# EAGLE schematic uC_ATMEL (EAGLE 7.1.0)

## Sheet 1 of 5: uC Pinout
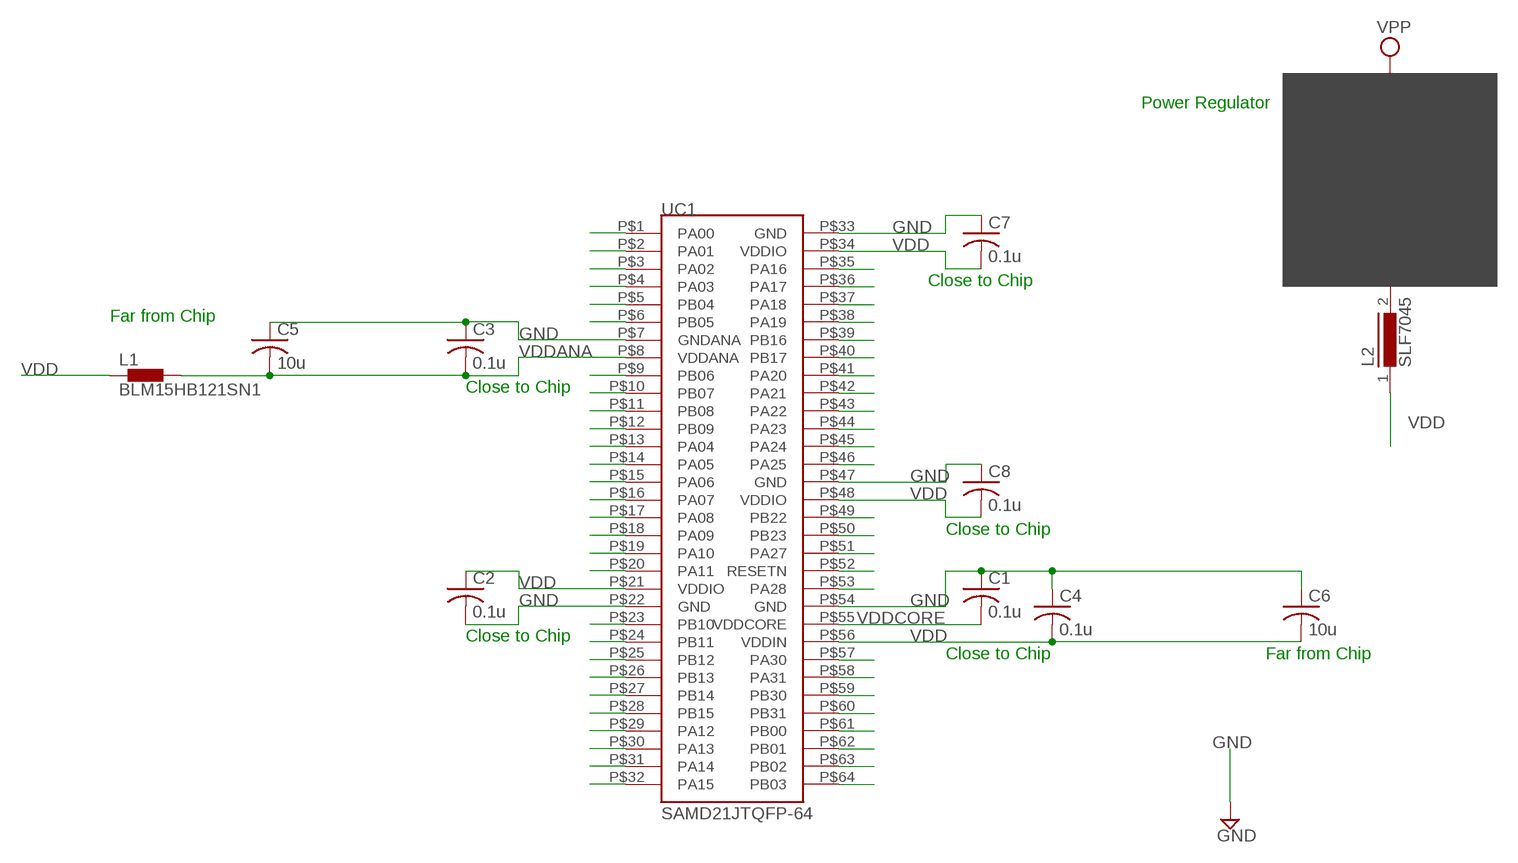
[diagram p0: schematic, sheet 1]

### Parts
C1  0.1u  C-USC1812  [C1812]
C2  0.1u  C-USC1812  [C1812]
C3  0.1u  C-USC1812  [C1812]
C4  0.1u  C-USC1812  [C1812]
C5  10u  C-USC1206  [C1206]
C6  10u  C-USC1206  [C1206]
C7  0.1u  C-USC1812  [C1812]
C8  0.1u  C-USC1812  [C1812]
L1  BLM15HB121SN1  [0402]
L2  SLF7045  [SLF7045]
UC1  SAMD21JTQFP-64  [TQFP-64]

### Nets
GND: C1.1 C2.2 C3.1 C4.1 C5.1 C6.1 C7.1 C8.1 UC1.P$7(GNDANA) UC1.P$22(GND) UC1.P$33(GND) UC1.P$47(GND) UC1.P$54(GND) ; also sheet 2,3,5
PA00: UC1.P$1(PA00)
PA01: UC1.P$2(PA01)
PA02: UC1.P$3(PA02)
PA03: UC1.P$4(PA03)
PA04: UC1.P$13(PA04) ; also sheet 3,5
PA05: UC1.P$14(PA05) ; also sheet 3,5
PA06: UC1.P$15(PA06)
PA07: UC1.P$16(PA07)
PA08: UC1.P$17(PA08)
PA09: UC1.P$18(PA09)
PA10: UC1.P$19(PA10)
PA11: UC1.P$20(PA11)
PA12: UC1.P$29(PA12)
PA13: UC1.P$30(PA13) ; also sheet 3
PA14: UC1.P$31(PA14) ; also sheet 3
PA15: UC1.P$32(PA15) ; also sheet 3
PA16: UC1.P$35(PA16) ; also sheet 3
PA17: UC1.P$36(PA17)
PA18: UC1.P$37(PA18)
PA19: UC1.P$38(PA19) ; also sheet 2
PA20: UC1.P$41(PA20) ; also sheet 2
PA21: UC1.P$42(PA21) ; also sheet 2
PA22: UC1.P$43(PA22) ; also sheet 3
PA23: UC1.P$44(PA23) ; also sheet 3
PA24: UC1.P$45(PA24)
PA25: UC1.P$46(PA25)
PA27: UC1.P$51(PA27) ; also sheet 5
PA28: UC1.P$53(PA28) ; also sheet 5
PA30: UC1.P$57(PA30) ; also sheet 2
PA31: UC1.P$58(PA31) ; also sheet 2
PB00: UC1.P$61(PB00) ; also sheet 3
PB01: UC1.P$62(PB01)
PB02: UC1.P$63(PB02)
PB03: UC1.P$64(PB03)
PB04: UC1.P$5(PB04)
PB05: UC1.P$6(PB05)
PB06: UC1.P$9(PB06)
PB07: UC1.P$10(PB07)
PB08: UC1.P$11(PB08)
PB09: UC1.P$12(PB09)
PB10: UC1.P$23(PB10)
PB11: UC1.P$24(PB11)
PB12: UC1.P$25(PB12)
PB13: UC1.P$26(PB13)
PB14: UC1.P$27(PB14)
PB15: UC1.P$28(PB15)
PB16: UC1.P$39(PB16) ; also sheet 2
PB17: UC1.P$40(PB17) ; also sheet 2
PB22: UC1.P$49(PB22) ; also sheet 5
PB23: UC1.P$50(PB23) ; also sheet 5
PB30: UC1.P$59(PB30)
PB31: UC1.P$60(PB31)
RESETN: UC1.P$52(RESETN) ; also sheet 2
VDD: C2.1 C4.2 C6.2 C7.2 C8.2 L1.1 L2.1 UC1.P$21(VDDIO) UC1.P$34(VDDIO) UC1.P$48(VDDIO) UC1.P$56(VDDIN) ; also sheet 2,3,5
VDDANA: C3.2 C5.2 L1.2 UC1.P$8(VDDANA)
VDDCORE: C1.2 UC1.P$55(VDDCORE)
Unconnected: L2.2

### Notes on the sheet
- Power Regulator
- Close to Chip
- Far from Chip
- Close to Chip
- Close to Chip
- Close to Chip
- Close to Chip | Far from Chip

## Sheet 2 of 5: Bootloading & Programming
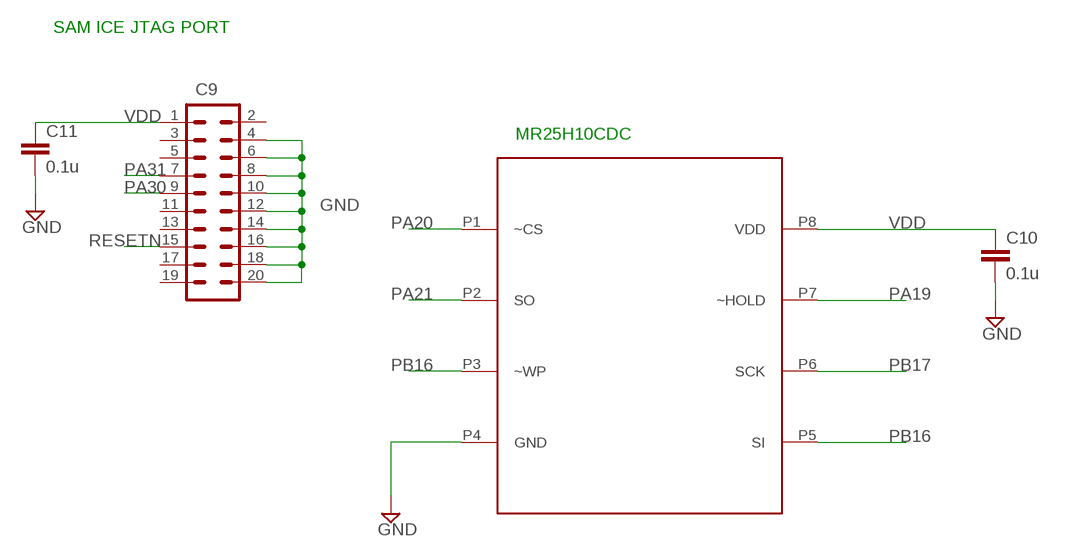
[diagram p1: schematic, sheet 2]

### Parts
C9  IDC_JTAG_CONNECTOR  [2X10]
C10  0.1u  CAP0805  [0805]
C11  0.1u  CAP0805  [0805]
U$1  MR25H10CDC  [8PXMO-229]

### Nets
GND: C9.4 C9.6 C9.8 C9.10 C9.12 C9.14 C9.16 C9.18 C9.20 C10.2 C11.2 U$1.P4(GND) ; also sheet 1,3,5
PA19: U$1.P7(~HOLD) ; also sheet 1
PA20: U$1.P1(~CS) ; also sheet 1
PA21: U$1.P2(SO) ; also sheet 1
PA30: C9.9 ; also sheet 1
PA31: C9.7 ; also sheet 1
PB16: U$1.P3(~WP) U$1.P5(SI) ; also sheet 1
PB17: U$1.P6(SCK) ; also sheet 1
RESETN: C9.15 ; also sheet 1
VDD: C9.1 C10.1 C11.1 U$1.P8(VDD) ; also sheet 1,3,5
Unconnected: C9.2 C9.3 C9.5 C9.11 C9.13 C9.17 C9.19

### Notes on the sheet
- SAM ICE JTAG PORT
- MR25H10CDC

## Sheet 3 of 5: TempSensing/Pwr/FlashCntrl
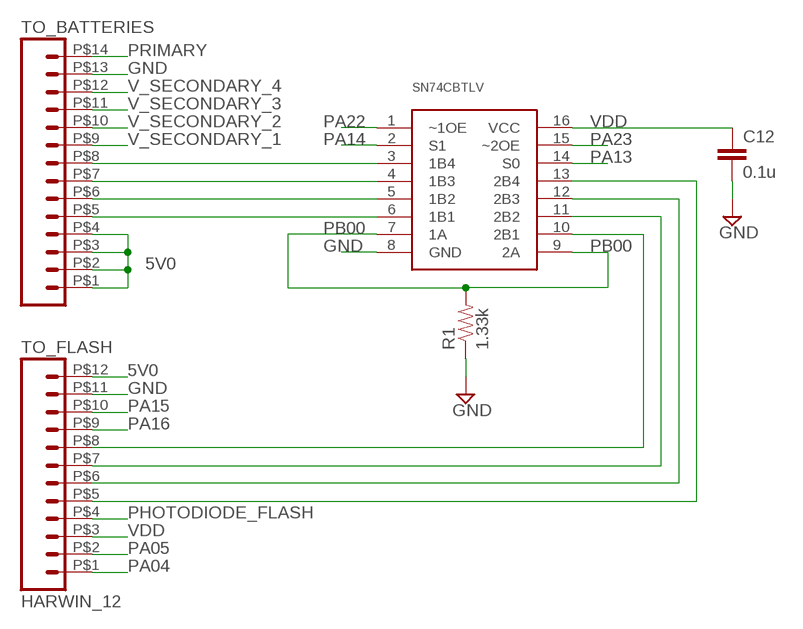
[diagram p2: schematic, sheet 3]

### Parts
C12  0.1u  CAP0805  [0805]
R1  1.33k  RESISTOR  [0805]
SN74CBTLV  SN74CBTLV3253  [SOIC16R]
TO_BATTERIES  HARWIN_14  [HARWIN_DATAMATE_14]
TO_FLASH  HARWIN_12  [HARWIN_DATAMATE_12]

### Nets
5V0: TO_BATTERIES.P$1 TO_BATTERIES.P$2 TO_BATTERIES.P$3 TO_BATTERIES.P$4 TO_FLASH.P$12
GND: C12.2 R1.1 SN74CBTLV.8(GND) TO_BATTERIES.P$13 TO_FLASH.P$11 ; also sheet 1,2,5
N$3: SN74CBTLV.3(1B4) TO_BATTERIES.P$8
N$4: SN74CBTLV.4(1B3) TO_BATTERIES.P$7
N$5: SN74CBTLV.5(1B2) TO_BATTERIES.P$6
N$6: SN74CBTLV.6(1B1) TO_BATTERIES.P$5
N$12: SN74CBTLV.13(2B4) TO_FLASH.P$5
N$13: SN74CBTLV.12(2B3) TO_FLASH.P$6
N$14: SN74CBTLV.11(2B2) TO_FLASH.P$7
N$15: SN74CBTLV.10(2B1) TO_FLASH.P$8
PA04: TO_FLASH.P$1 ; also sheet 1,5
PA05: TO_FLASH.P$2 ; also sheet 1,5
PA13: SN74CBTLV.14(S0) ; also sheet 1
PA14: SN74CBTLV.2(S1) ; also sheet 1
PA15: TO_FLASH.P$10 ; also sheet 1
PA16: TO_FLASH.P$9 ; also sheet 1
PA22: SN74CBTLV.1(~1OE) ; also sheet 1
PA23: SN74CBTLV.15(~2OE) ; also sheet 1
PB00: R1.2 SN74CBTLV.7(1A) SN74CBTLV.9(2A) ; also sheet 1
PHOTODIODE_FLASH: TO_FLASH.P$4
PRIMARY: TO_BATTERIES.P$14
V_SECONDARY_1: TO_BATTERIES.P$9
V_SECONDARY_2: TO_BATTERIES.P$10
V_SECONDARY_3: TO_BATTERIES.P$11
V_SECONDARY_4: TO_BATTERIES.P$12
VDD: C12.1 SN74CBTLV.16(VCC) TO_FLASH.P$3 ; also sheet 1,2,5

## Sheet 4 of 5
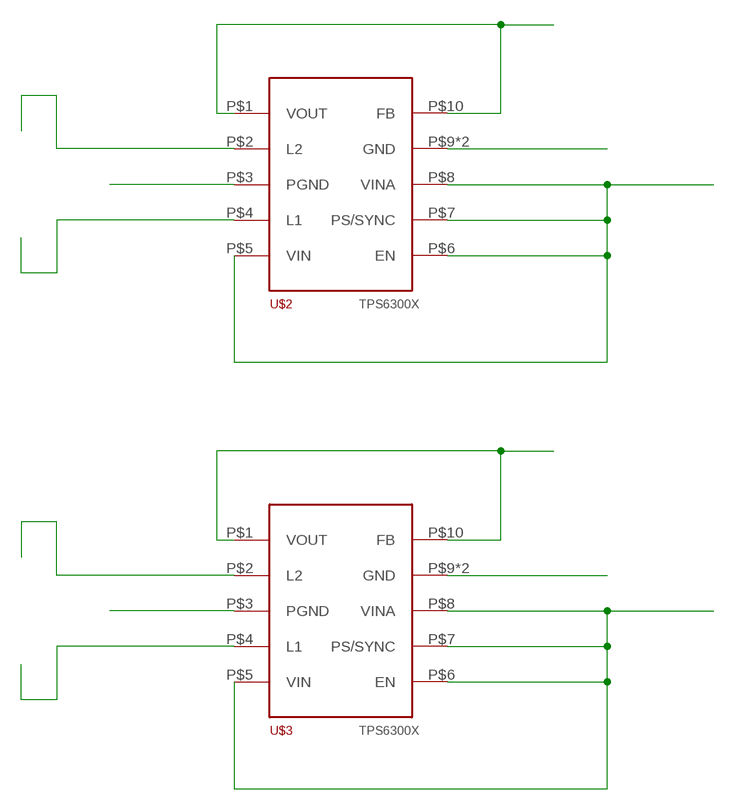
[diagram p3: schematic, sheet 4]

### Parts
U$2  TPS6300X  [QFN10_POWERPAD]
U$3  TPS6300X  [QFN10_POWERPAD]

### Nets
N$1: U$2.P$5(VIN) U$2.P$6(EN) U$2.P$7(PS/SYNC) U$2.P$8(VINA)
N$2: U$3.P$5(VIN) U$3.P$6(EN) U$3.P$7(PS/SYNC) U$3.P$8(VINA)
N$7: U$3.P$2(L2)
N$8: U$2.P$2(L2)
N$9: U$2.P$4(L1)
N$10: U$3.P$4(L1)
N$11: U$2.P$1(VOUT) U$2.P$10(FB)
N$16: U$2.P$9(GND) U$2.PAD(GND)
N$17: U$2.P$3(PGND)
N$18: U$3.P$1(VOUT) U$3.P$10(FB)
N$19: U$3.P$9(GND) U$3.PAD(GND)
N$20: U$3.P$3(PGND)

## Sheet 5 of 5
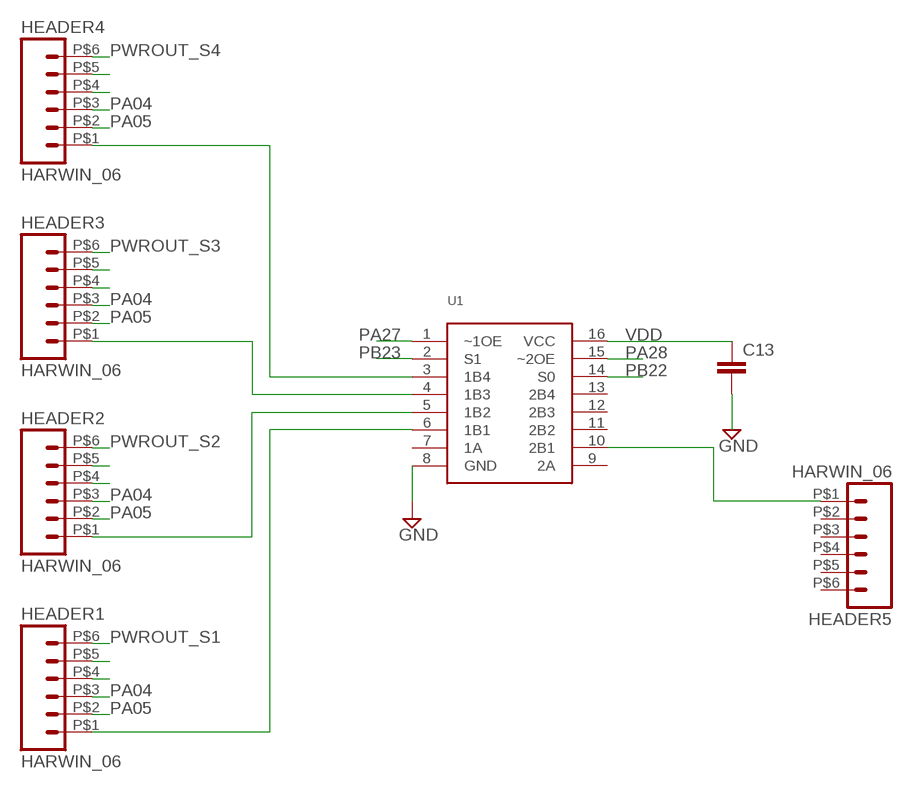
[diagram p4: schematic, sheet 5]

### Parts
C13  CAP0805  [0805]
HEADER1  HARWIN_06  [HARWIN_DATAMATE_6]
HEADER2  HARWIN_06  [HARWIN_DATAMATE_6]
HEADER3  HARWIN_06  [HARWIN_DATAMATE_6]
HEADER4  HARWIN_06  [HARWIN_DATAMATE_6]
HEADER5  HARWIN_06  [HARWIN_DATAMATE_6]
U1  SN74CBTLV3253  [SOIC16R]

### Nets
GND: U1.8(GND) ; also sheet 1,2,3
N$21: HEADER1.P$1 U1.6(1B1)
N$22: HEADER2.P$1 U1.5(1B2)
N$23: HEADER3.P$1 U1.4(1B3)
N$24: HEADER4.P$1 U1.3(1B4)
N$25: HEADER5.P$1 U1.10(2B1)
N$26: C13.2
N$27: HEADER4.P$4
N$28: HEADER4.P$5
N$29: HEADER3.P$4
N$30: HEADER3.P$5
N$31: HEADER2.P$4
N$32: HEADER2.P$5
N$33: HEADER1.P$4
N$34: HEADER1.P$5
PA04: HEADER1.P$3 HEADER2.P$3 HEADER3.P$3 HEADER4.P$3 ; also sheet 1,3
PA05: HEADER1.P$2 HEADER2.P$2 HEADER3.P$2 HEADER4.P$2 ; also sheet 1,3
PA27: U1.1(~1OE) ; also sheet 1
PA28: U1.15(~2OE) ; also sheet 1
PB22: U1.14(S0) ; also sheet 1
PB23: U1.2(S1) ; also sheet 1
PWROUT_S1: HEADER1.P$6
PWROUT_S2: HEADER2.P$6
PWROUT_S3: HEADER3.P$6
PWROUT_S4: HEADER4.P$6
VDD: C13.1 U1.16(VCC) ; also sheet 1,2,3
Unconnected: HEADER5.P$2 HEADER5.P$3 HEADER5.P$4 HEADER5.P$5 HEADER5.P$6 U1.7(1A) U1.9(2A) U1.11(2B2) U1.12(2B3) U1.13(2B4)

## Library data of the parts
C1-C8 = rcl:C-US: CAPACITOR, American symbol
C9 = CNTRL_BOARD:IDC_JTAG_CONNECTOR
C10-C13 = CNTRL_BOARD:CAP: Capacitor Standard 0603 ceramic capacitor, and 0.1" leaded capacitor.
HEADER1-HEADER5 = CNTRL_BOARD:HARWIN_06
L1 = inductors:BLM15H: EMIFIL (R) Chip Ferrite Bead for GHz Noise Source: http://www.murata.com/ Ferrite Bead BLM15H.pdf
L2 = inductors:SLF7045: SMD Inductors(Coils) For Power Line (Wound, Magnetic Shielded) Source: TDK, e531_slf7045.pdf
R1 = CNTRL_BOARD:RESISTOR
SN74CBTLV U1 = CNTRL_BOARD:SN74CBTLV3253
TO_BATTERIES = CNTRL_BOARD:HARWIN_14
TO_FLASH = CNTRL_BOARD:HARWIN_12
U$1 = mram:MR25H10CDC
U$2 U$3 = CNTRL_BOARD:TPS6300X
UC1 = SAMD21J:SAMD21J